# EAGLE schematic Circuito elétrico (EAGLE 9.6.2)
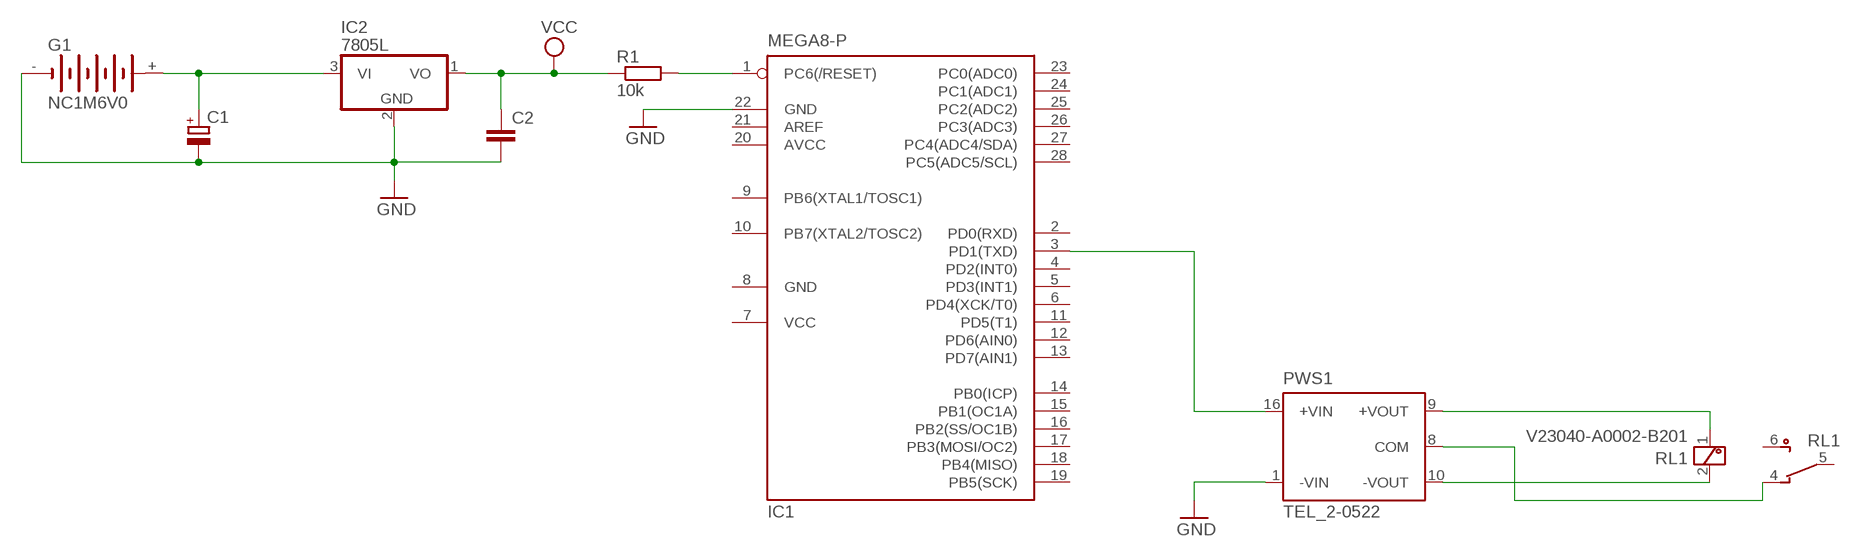
[diagram p0: schematic, sheet 1]

## Parts
C1  CPOL-EUE5-10.5  [E5-10,5]
C2  C-EU075-032X103  [C075-032X103]
G1  NC1M6V0  [NC1M]
IC1  MEGA8-P  [DIL28-3]
IC2  7805L  [TO92]
PWS1  TEL_2-0522  [TRACOPOWER2W]
R1  10k  R-EU_0204/7  [0204/7]
RL1  V23040-A0002-B201  [V23040201]

## Nets
GND: C1.- C2.2 G1.- IC1.22(GND) IC2.2(GND) PWS1.1(-VIN)
N$1: IC1.3(PD1(TXD)) PWS1.16(+VIN)
N$2: PWS1.10(-VOUT) RL1.2
N$3: PWS1.9(+VOUT) RL1.1
N$4: PWS1.8(COM) RL1.4
N$5: IC1.1(PC6(/RESET)) R1.2
N$7: C1.+ G1.+ IC2.3(VI)
VCC: C2.1 IC2.1(VO) R1.1
Unconnected: IC1.2(PD0(RXD)) IC1.4(PD2(INT0)) IC1.5(PD3(INT1)) IC1.6(PD4(XCK/T0)) IC1.9(PB6(XTAL1/TOSC1)) IC1.10(PB7(XTAL2/TOSC2)) IC1.11(PD5(T1)) IC1.12(PD6(AIN0)) IC1.13(PD7(AIN1)) IC1.14(PB0(ICP)) IC1.15(PB1(OC1A)) IC1.16(PB2(SS/OC1B)) IC1.17(PB3(MOSI/OC2)) IC1.18(PB4(MISO)) IC1.19(PB5(SCK)) IC1.21(AREF) IC1.23(PC0(ADC0)) IC1.24(PC1(ADC1)) IC1.25(PC2(ADC2)) IC1.26(PC3(ADC3)) IC1.27(PC4(ADC4/SDA)) IC1.28(PC5(ADC5/SCL)) RL1.3 RL1.5 RL1.6

## Power pins joined to a net without a drawn wire
AVCC: IC1.20(AVCC)
GND: IC1.8(GND)
VCC: IC1.7(VCC)

## Library data of the parts
C1 = rcl:CPOL-EU: POLARIZED CAPACITOR, European symbol; SPICEPREFIX: C
C2 = rcl:C-EU: CAPACITOR, European symbol; SPICEPREFIX: C
G1 = battery:NC1M6V0: NC ACCU Sonnenschein Mini-Memo NC-M 6.0V R5
IC1 = atmel:MEGA8-P: MICROCONTROLLER 8 Kbytes FLASH, 1 kbytes SRAM, 512 bytes EEPROM, USART, 4-channel 10 bit ADC, 2-channel 8 bit ADC Pin compatible with Atmega48, ATMega88, ATMega168 Source: avr.lbr; OC_FARNELL: unknown; OC_NEWARK: unknown
IC2 = linear:78*: Positive VOLTAGE REGULATOR Source: http://cache.national.com/ds/LM/LM78L05.pdf http://www.fairchildsemi.com/ds/LM/LM7805.pdf
PWS1 = traco-electronic:TEL_2-: DC/DC-Konverter 2 Watt, 1 x Input, 1 x +- Output Source: http://www.tracopower.com/datasheet_g/tel2-d.pdf; MPN: TEL 2-0522; OC_FARNELL: 1007028; OC_NEWARK: 51R4756
R1 = rcl:R-EU_: RESISTOR, European symbol; SPICEPREFIX: R
RL1 = relay:V23040-*-B201: SIEMENS Monostabil A0001 = 5V; A0002 = 12V; A0003 = 15V; A0004 = 24V Bistabil C0051 = 5V; C0052 = 12V; MPN: V23040-A0002-B201; OC_FARNELL: 1174994; OC_NEWARK: 24M9075